# Altium schematic sheet ADC.SchDoc
size A4
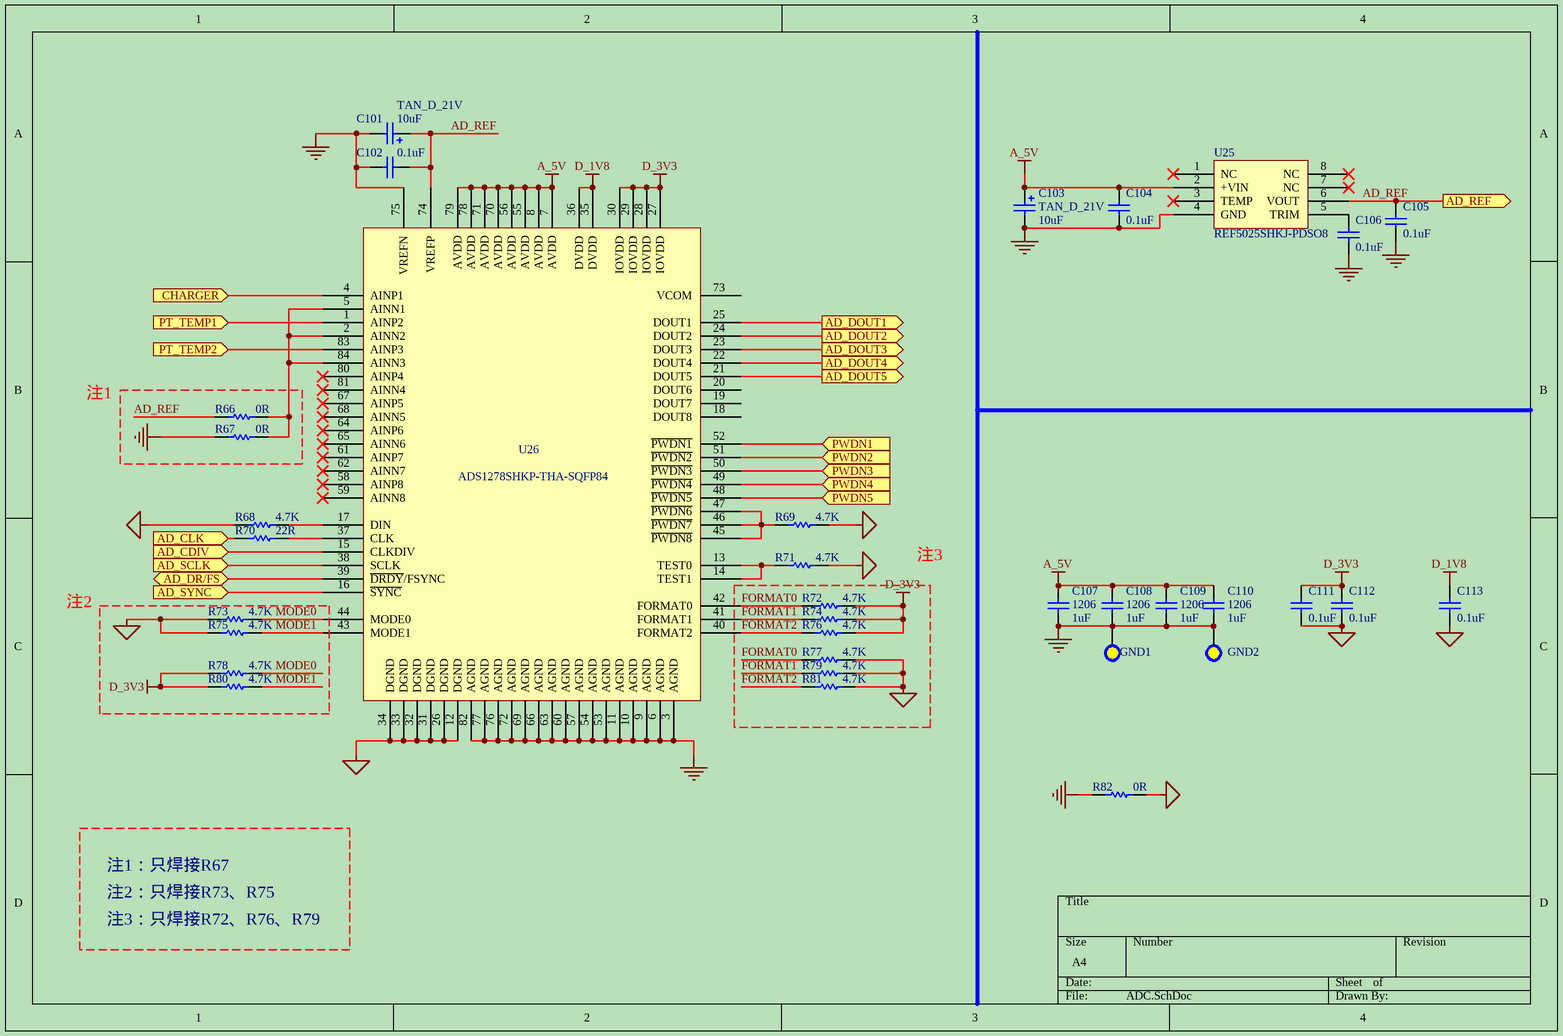
[diagram p0: ADC.SchDoc]

## Parts
C101  TAN_D_21V  value 10uF  [CAPSP_2q2917]
C102  value 0.1uF  [CAPS0805_57]  (hidden comment: Cap)
C103  TAN_D_21V  value 10uF  [CAPSP_2q2917]
C104  value 0.1uF  [CAPS0805_57]  (hidden comment: Cap)
C105  value 0.1uF  [CAPS0805_57]  (hidden comment: Cap)
C106  value 0.1uF  [CAPS0805_57]  (hidden comment: Cap)
C107  1206  value 1uF  [CAPS1206_43]
C108  1206  value 1uF  [CAPS1206_43]
C109  1206  value 1uF  [CAPS1206_43]
C110  1206  value 1uF  [CAPS1206_43]
C111  value 0.1uF  [CAPS0805_57]  (hidden comment: Cap)
C112  value 0.1uF  [CAPS0805_57]  (hidden comment: Cap)
C113  value 0.1uF  [CAPS0805_57]  (hidden comment: Cap)
GND1  TST_LARGE  [test_large]  (value not drawn)
GND2  TST_LARGE  [test_large]  (value not drawn)
R66  value 0R  [RESS0805]  (hidden comment: Res)
R67  value 0R  [RESS0805]  (hidden comment: Res)
R68  value 4.7K  [RESS0805]  (hidden comment: Res)
R69  value 4.7K  [RESS0805]  (hidden comment: Res)
R70  value 22R  [RESS0805]  (hidden comment: Res)
R71  value 4.7K  [RESS0805]  (hidden comment: Res)
R72  value 4.7K  [RESS0805]  (hidden comment: Res)
R73  value 4.7K  [RESS0805]  (hidden comment: Res)
R74  value 4.7K  [RESS0805]  (hidden comment: Res)
R75  value 4.7K  [RESS0805]  (hidden comment: Res)
R76  value 4.7K  [RESS0805]  (hidden comment: Res)
R77  value 4.7K  [RESS0805]  (hidden comment: Res)
R78  value 4.7K  [RESS0805]  (hidden comment: Res)
R79  value 4.7K  [RESS0805]  (hidden comment: Res)
R80  value 4.7K  [RESS0805]  (hidden comment: Res)
R81  value 4.7K  [RESS0805]  (hidden comment: Res)
R82  value 0R  [RESS0805]  (hidden comment: Res)
U25  REF5025SHKJ-PDSO8  [PDSO8]
U26  ADS1278SHKP-THA-SQFP84  [HB-CQFP_84q1933×1933×280_p50 - duplicate]

## Ports
AD_CDIV (in), AD_CLK (in), AD_DOUT1 (out), AD_DOUT2 (out), AD_DOUT3 (out), AD_DOUT4 (out), AD_DOUT5 (out), AD_DR/FS (bidir), AD_REF (out), AD_SCLK (in), AD_SYNC (in), CHARGER (in), PT_TEMP1 (in), PT_TEMP2 (in), PWDN1 (in), PWDN2 (in), PWDN3 (in), PWDN4 (in), PWDN5 (in)

## Nets
A_5V: C103.1 C104.2 C107.2 C108.2 C109.2 C110.2 U25.2(+VIN) U26.7(AVDD) U26.8(AVDD) U26.55(AVDD) U26.56(AVDD) U26.70(AVDD) U26.71(AVDD) U26.78(AVDD) U26.79(AVDD)
D_1V8: C113.2 U26.35(DVDD) U26.36(DVDD)
D_3V3: C111.2 C112.2 R72.1 R74.1 R76.1 R78.2 R80.2 U26.27(IOVDD) U26.28(IOVDD) U26.29(IOVDD) U26.30(IOVDD)
DGND: C111.1 C112.1 C113.1 R68.2 R69.1 R71.1 R73.2 R75.2 R77.1 R79.1 R81.1 R82.1 U26.12(DGND) U26.26(DGND) U26.31(DGND) U26.32(DGND) U26.33(DGND) U26.34(DGND)
GND: C101.2 C102.2 C103.2 C104.1 C105.1 C106.1 C107.1 C108.1 C109.1 C110.1 GND1.1 GND2.1 R67.2 R82.2 U25.4(GND) U26.3(AGND) U26.6(AGND) U26.9(AGND) U26.10(AGND) U26.11(AGND) U26.53(AGND) U26.54(AGND) U26.57(AGND) U26.60(AGND) U26.63(AGND) U26.66(AGND) U26.69(AGND) U26.72(AGND) U26.75(VREFN) U26.76(AGND) U26.77(AGND) U26.82(AGND)
AD_CDIV: U26.15(CLKDIV) ; port AD_CDIV
AD_CLK: R70.2 ; port AD_CLK
AD_DOUT1: U26.25(DOUT1) ; port AD_DOUT1
AD_DOUT2: U26.24(DOUT2) ; port AD_DOUT2
AD_DOUT3: U26.23(DOUT3) ; port AD_DOUT3
AD_DOUT4: U26.22(DOUT4) ; port AD_DOUT4
AD_DOUT5: U26.21(DOUT5) ; port AD_DOUT5
AD_DR/FS: U26.39(~{DRDY}/FSYNC) ; port AD_DR/FS
AD_REF: C101.1 C102.1 C105.2 R66.2 U25.6(VOUT) U26.74(VREFP) ; port AD_REF
AD_SCLK: U26.38(SCLK) ; port AD_SCLK
AD_SYNC: U26.16(~{SYNC}) ; port AD_SYNC
CHARGER: U26.4(AINP1) ; port CHARGER
FORMAT0: R72.2 R77.2 U26.42(FORMAT0)
FORMAT1: R74.2 R79.2 U26.41(FORMAT1)
FORMAT2: R76.2 R81.2 U26.40(FORMAT2)
MODE0: R73.1 R78.1 U26.44(MODE0)
MODE1: R75.1 R80.1 U26.43(MODE1)
PT_TEMP1: U26.1(AINP2) ; port PT_TEMP1
PT_TEMP2: U26.83(AINP3) ; port PT_TEMP2
PWDN1: U26.52(~{PWDN1}) ; port PWDN1
PWDN2: U26.51(~{PWDN2}) ; port PWDN2
PWDN3: U26.50(~{PWDN3}) ; port PWDN3
PWDN4: U26.49(~{PWDN4}) ; port PWDN4
PWDN5: U26.48(~{PWDN5}) ; port PWDN5
NetC106_2: C106.2 U25.5(TRIM)
NetR66_1: R66.1 R67.1 U26.2(AINN2) U26.5(AINN1) U26.84(AINN3)
NetR68_1: R68.1 U26.17(DIN)
NetR69_2: R69.2 U26.45(~{PWDN8}) U26.46(~{PWDN7}) U26.47(~{PWDN6})
NetR70_1: R70.1 U26.37(CLK)
NetR71_2: R71.2 U26.13(TEST0) U26.14(TEST1)

Not connected (* = marked no-connect by the designer): U25 1(NC)* 3(TEMP)* 7(NC)* 8(NC)*; U26 18(DOUT8) 19(DOUT7) 20(DOUT6) 58(AINP8)* 59(AINN8)* 61(AINP7)* 62(AINN7)* 64(AINP6)* 65(AINN6)* 67(AINP5)* 68(AINN5)* 73(VCOM) 80(AINP4)* 81(AINN4)*

## Notes on the sheet
- 注1
- 注3
- 注2
- 注1：只焊接R67
- 注2：只焊接R73、R75
- 注3：只焊接R72、R76、R79

## Library data of the parts
C101 C103 = Y20024818: Polarized Capacitor; 制造商型号: T499D106K050AT; 精度: ±10%; 描述: KEMET;T499D106K050AT;10uF;±10%;50V;175℃;CAP2917; 安装形式: SMT; 产品外形尺寸<长>: 7.3±0.30mm; 产品外形尺寸<宽>: 4.3±0.30mm; 产品外形尺寸<高>: 2.8±0.30mm; id: wt.part.WTPartMaster:1056718; state: APPROVED; folder: /Default/电容/T499D106K050AT; Part Number: Y20024818; HelpURL: \\10.185.226.160\altium_center_db\DATASHEET\KEMET T498&T499ns.pdf; pname: T499D106K050AT
C102 C104-C106 C111-C113 = Y20025084: Capacitor; 制造商型号: VJ0805H104KXA; parent: 01; 精度: ±10%; 描述: VISHAY;VJ0805H104KXA;0.1uF;±10%;50V;X8R;150℃;CAP0805; 安装形式: SMT; 湿敏等级（回流焊峰值）: 0; 产品外形尺寸<长>: 0.079±0.008 in; 产品外形尺寸<宽>: 0.049±0.008 in; 产品外形尺寸<高>: 0.057 in; id: wt.part.WTPartMaster:1053152; state: APPROVED; folder: /Default/电容/VJ0805H104KXA; Part Number: Y20025084; HelpURL: \\10.185.226.160\altium_center_db\DATASHEET\VISHAY VJ X8R.pdf; Library Path: Cap.SchLib; Library Ref: Cap; Footprint Path: VISHAY VJ0805_57.PcbLib; Footprint Ref: CAPS0805_57; pname: VJ0805H104KXA; Library Path 2: 0; Library Ref 2: 0; Footprint Path 2: 0; Footprint Ref 2: 0; Footprint Path 3: 0; Footprint Ref 3: 0
C107-C110 = Y20024113: Capacitor; 制造商型号: C1206C105K5RAC; parent: 01; 精度: ±10%; 描述: KEMET;C1206C105K5RAC;1uF;±10%;50V;X7R;125℃;CAP1206 MSL1; 安装形式: SMT; 湿敏等级（回流焊峰值）: MSL1; 产品外形尺寸<长>: 3.2±0.2 mm; 产品外形尺寸<宽>: 1.6±0.2 mm; 产品外形尺寸<高>: 1.0±0.1 mm; Library Path 2: 0; id: wt.part.WTPartMaster:1055130; state: APPROVED; folder: /Default/电容/C1206C105K5RAC; Part Number: Y20024113; HelpURL: \\10.185.226.160\altium_center_db\DATASHEET\KEMET X7R Dielectric(Commercial Grade).pdf; Library Path: Cap.SchLib; Library Ref: Cap; Footprint Path: KEMET C1206_43.PcbLib; Footprint Ref: CAPS1206_43; pname: C1206C105K5RAC; Library Ref 2: 0; Footprint Path 2: 0; Footprint Ref 2: 0; Footprint Path 3: 0; Footprint Ref 3: 0
GND1 GND2 = TEST_LARGE
R66-R82 = Res: Semiconductor Resistor; Manufacturer: Generic Components; Class: Passive; Published: 08/06/2000; Publisher: Altium Hobart Technology Centre; SubClass: Resistor
U25 = REF5025ID
U26 = ADS1278SHFQ